# Altium schematic sheet door_fan_bell.SchDoc
size A4
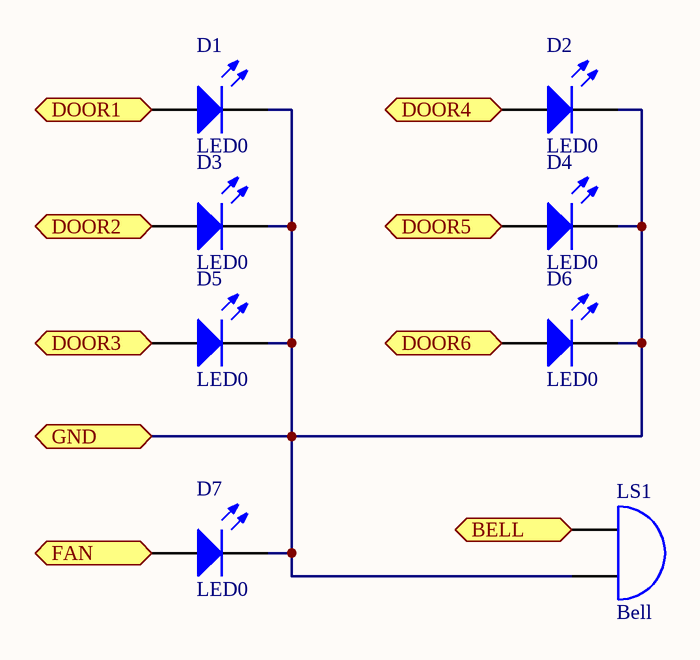
[diagram p0: door_fan_bell.SchDoc]

## Parts
D1  LED0  [1206]
D2  LED0  [1206]
D3  LED0  [1206]
D4  LED0  [1206]
D5  LED0  [1206]
D6  LED0  [1206]
D7  LED0  [1206]
LS1  Bell  [蜂鸣器]

## Ports
BELL, DOOR1, DOOR2, DOOR3, DOOR4, DOOR5, DOOR6, FAN, GND

## Nets
BELL: LS1.1(A) ; port BELL
DOOR1: D1.1(A) ; port DOOR1
DOOR2: D3.1(A) ; port DOOR2
DOOR3: D5.1(A) ; port DOOR3
DOOR4: D2.1(A) ; port DOOR4
DOOR5: D4.1(A) ; port DOOR5
DOOR6: D6.1(A) ; port DOOR6
FAN: D7.1(A) ; port FAN
GND: D1.2(K) D2.2(K) D3.2(K) D4.2(K) D5.2(K) D6.2(K) D7.2(K) LS1.2(B) ; port GND

## Library data of the parts
D1-D7 = LED0: Typical INFRARED GaAs LED; Published: 8-Jun-2000; LatestRevisionDate: 08-Jul-2005; LatestRevisionNote: Mech Layer 1 removed.; PackageReference: LED-0; Publisher: Altium Limited; PackageDescription: LED; 2 Leads
LS1 = Bell: Electrical Bell; Published: 24-Mar-1999; LatestRevisionDate: 17-Jul-2002; LatestRevisionNote: Re-released for DXP Platform.; PackageReference: PIN2; Publisher: Altium Limited